# Altium schematic sheet Scan.SchDoc
size A4
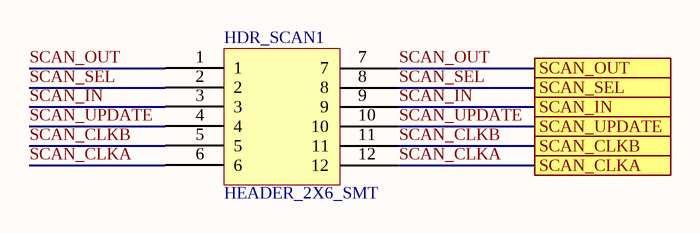
[diagram p0: Scan.SchDoc]

## Parts
HDR_SCAN1  HEADER_2X6_SMT  [HDR2X6_SMT]

## Ports
SCAN_CLKA, SCAN_CLKB, SCAN_IN, SCAN_OUT, SCAN_SEL, SCAN_UPDATE

## Nets
SCAN_CLKA: HDR_SCAN1.6 HDR_SCAN1.12 ; port SCAN_CLKA
SCAN_CLKB: HDR_SCAN1.5 HDR_SCAN1.11 ; port SCAN_CLKB
SCAN_IN: HDR_SCAN1.3 HDR_SCAN1.9 ; port SCAN_IN
SCAN_OUT: HDR_SCAN1.1 HDR_SCAN1.7 ; port SCAN_OUT
SCAN_SEL: HDR_SCAN1.2 HDR_SCAN1.8 ; port SCAN_SEL
SCAN_UPDATE: HDR_SCAN1.4 HDR_SCAN1.10 ; port SCAN_UPDATE